# Altium project Bass Guitar Amp.PrjPcb (part 4 of 4)

## Sheet SideGig.SchDoc
size C
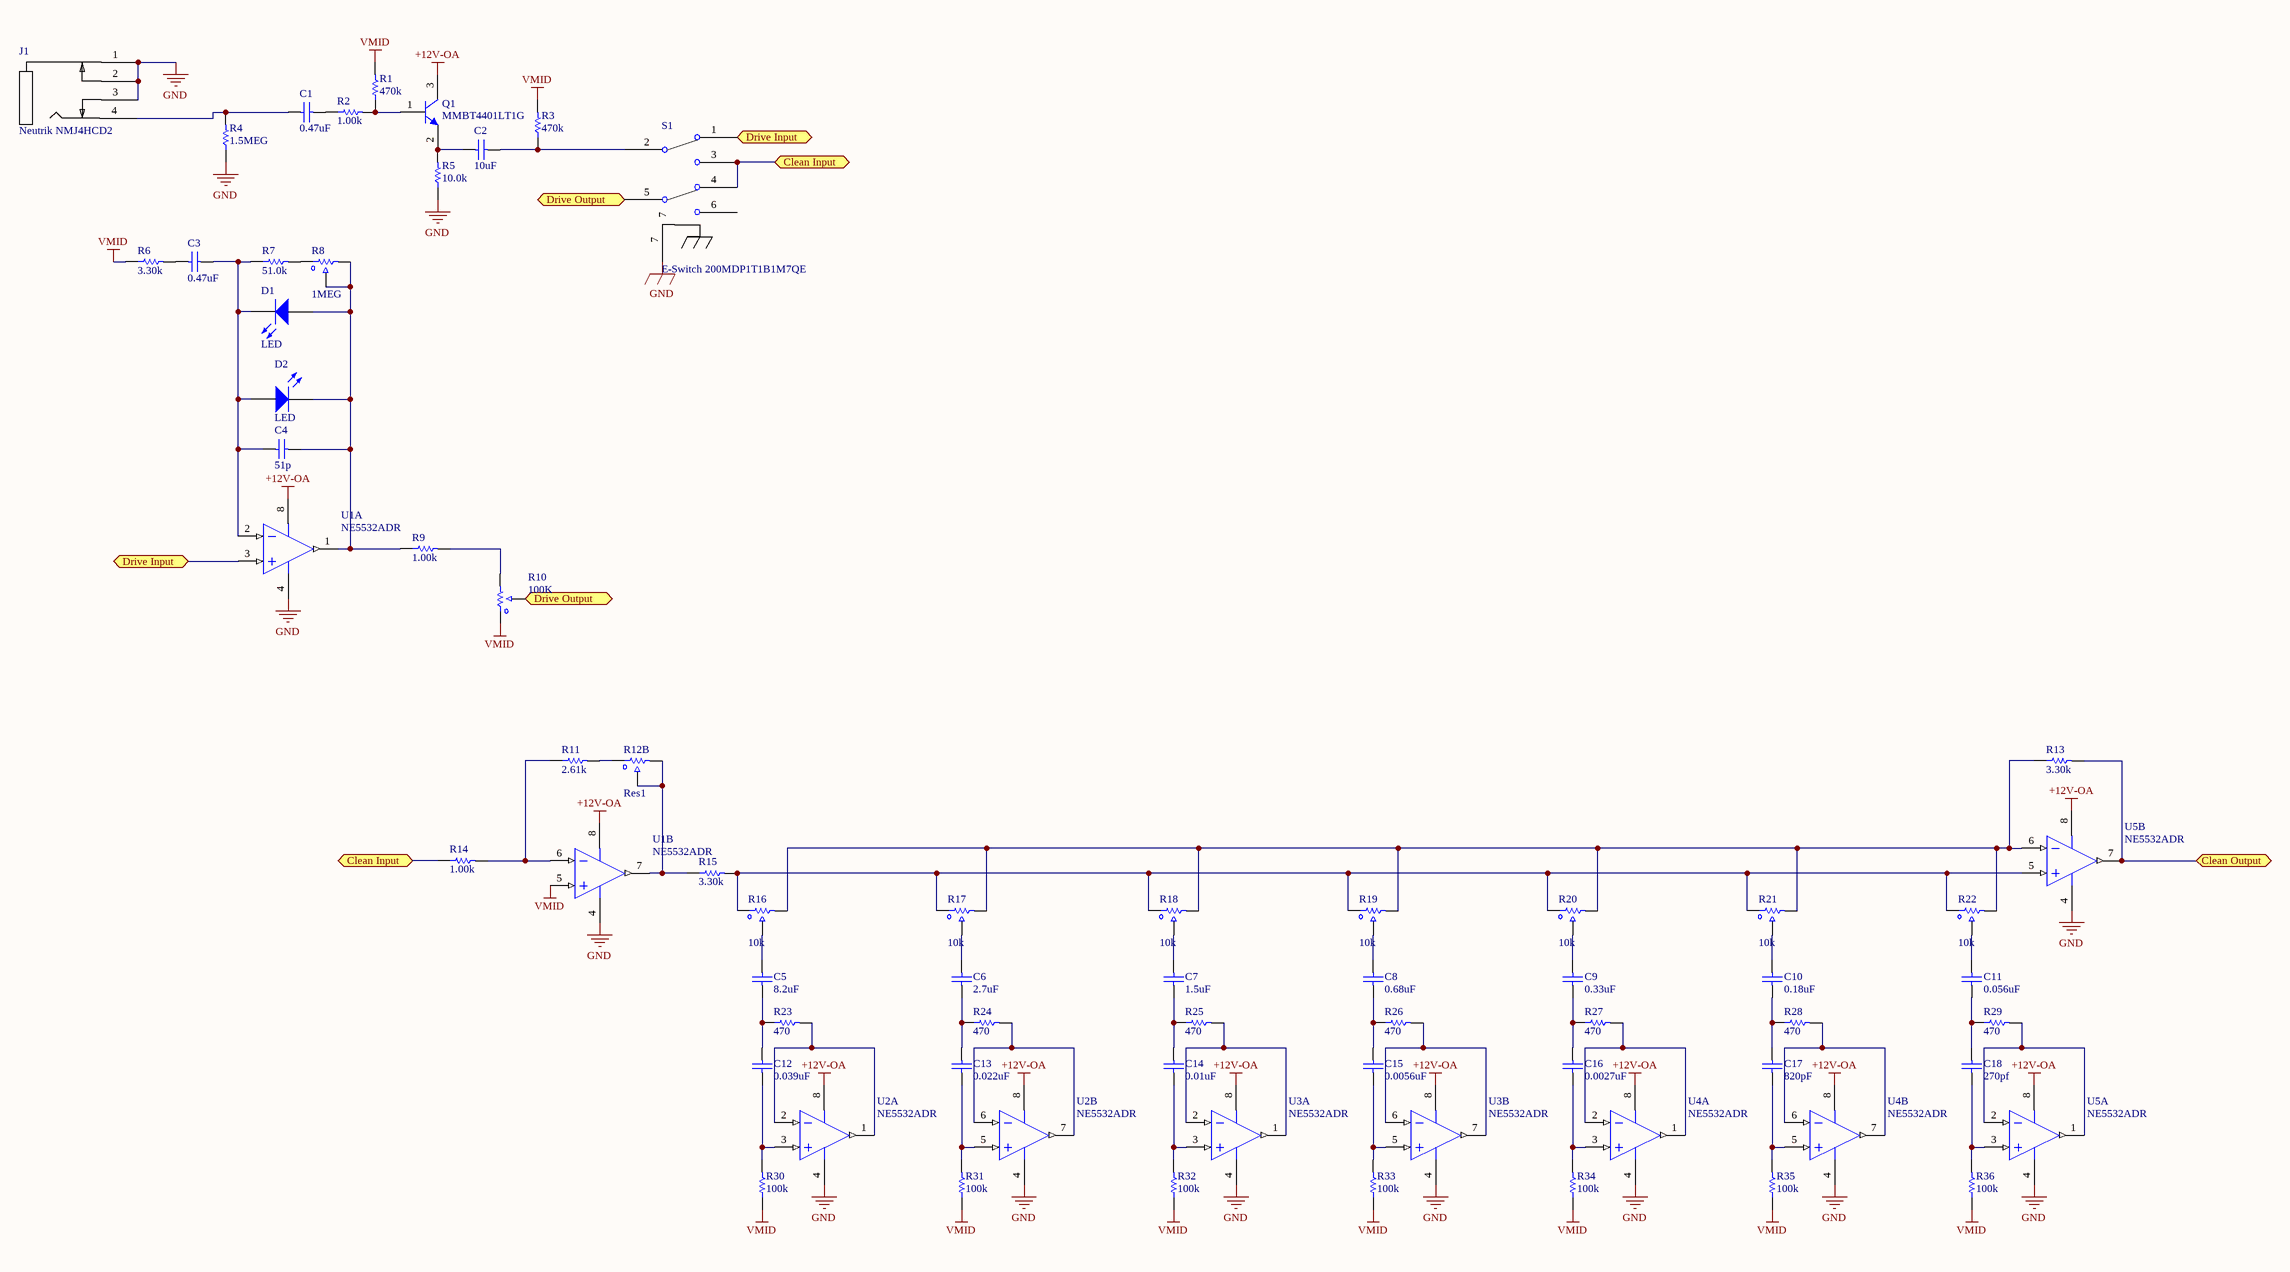
[diagram p4: SideGig.SchDoc]

### Parts
C1  0.47uF  [KEMET-CAP-R82-3.5x7.2x7.5]
C2  10uF  [PCB-5c5sxu4lzqbcrp2k6kwf-1]
C3  0.47uF  [KEMET-CAP-R82-3.5x7.2x7.5]
C4  51p  [PCB-95jwzqqszc08wacjm7pt-1]
C5  8.2uF  [PCB-c6m1kdim6qcj8izte1nm-1]
C6  2.7uF  [PCB-0jy2cnoig77n7x90nrde-1]
C7  1.5uF  [PNSC-ECW-FA2J104J-2_V]
C8  0.68uF  [PCB-u2hk6yule89p95nzo6je-1]
C9  0.33uF  [PCB-6op8lio2jwcmvqj359j9-1]
C10  0.18uF  [PCB-0jy2cnoig77n7x90nrde-1]
C11  0.056uF  [CAPC3216X180X55NL20T25]
C12  0.039uF  [CAPC3216X125X55NL15T25]
C13  0.022uF  [PCB-4ogqrbmu6k7z43hywnoj-1]
C14  0.01uF  [CAPC1608X90X35ML10T15]
C15  0.0056uF  [CAPC1608X90X35NL10T15]
C16  0.0027uF  [CAPC1608X90X35ML10T15]
C17  820pF  [PCB-ek4a7t2xlu3b3uffgdw1-1]
C18  270pf  [PCB-tqk94dkdaskokld6sqgm-1]
D1  LED  [PCB-zilynnwjnvy4h7a9jrio-1]
D2  LED  [PCB-xdpqkswxioq5a4c2f505-1]
J1  Neutrik NMJ4HCD2  [PCB-ulk4fqr0p4xs83lqqzbi-1]
Q1  MMBT4401LT1G  [ONSC-SOT-23-3-318-08_V]
R1  470k  [RESC1609X55X28LL05T18]
R2  1.00k  [RESC1609X55X28LL05T18]
R3  470k  [RESC1609X55X28LL05T18]
R4  1.5MEG  [RESC1608X55X30LL15T15]
R5  10.0k  [RESC1609X55X28LL05T18]
R6  3.30k  [RESC1609X55X28LL05T18]
R7  51.0k  [RESC1609X55X28LL05T18]
R8  1MEG  [PCB-qt6dwgo6hvmsfr7xkbkw-1]
R9  1.00k  [RESC1609X55X28LL05T18]
R10  100K  [PCB-3c7eria7znpasna51pjn-1]
R11  2.61k  [PCB-2fy4x9bysi6rpexrr8fu-1]
R12  Res1  [PCB-3c7eria7znpasna51pjn-1]  (part B of 2)
R13  3.30k  [RESC1609X55X28LL05T18]
R14  1.00k  [RESC1609X55X28LL05T18]
R15  3.30k  [RESC1609X55X28LL05T18]
R16  10k  [PCB-3c7eria7znpasna51pjn-1]
R17  10k  [PCB-3c7eria7znpasna51pjn-1]
R18  10k  [PCB-3c7eria7znpasna51pjn-1]
R19  10k  [PCB-3c7eria7znpasna51pjn-1]
R20  10k  [PCB-3c7eria7znpasna51pjn-1]
R21  10k  [PCB-3c7eria7znpasna51pjn-1]
R22  10k  [PCB-3c7eria7znpasna51pjn-1]
R23  470  [RESC1609X55X28LL05T18]
R24  470  [RESC1609X55X28LL05T18]
R25  470  [RESC1609X55X28LL05T18]
R26  470  [RESC1609X55X28LL05T18]
R27  470  [RESC1609X55X28LL05T18]
R28  470  [RESC1609X55X28LL05T18]
R29  470  [RESC1609X55X28LL05T18]
R30  100k  [RESC1609X55X28LL05T18]
R31  100k  [RESC1609X55X28LL05T18]
R32  100k  [RESC1609X55X28LL05T18]
R33  100k  [RESC1609X55X28LL05T18]
R34  100k  [RESC1609X55X28LL05T18]
R35  100k  [RESC1609X55X28LL05T18]
R36  100k  [RESC1609X55X28LL05T18]
S1  E-Switch 200MDP1T1B1M7QE  [PCB-n7wal9a472qnn3v0pqv9-1]
U1  NE5532ADR  [TI-D8_L]  (parts A,B of 2)
U2  NE5532ADR  [TI-D8_L]  (parts A,B of 2)
U3  NE5532ADR  [TI-D8_L]  (parts A,B of 2)
U4  NE5532ADR  [TI-D8_L]  (parts A,B of 2)
U5  NE5532ADR  [TI-D8_L]  (parts A,B of 2)

### Ports
Clean Input, Clean Output, Drive Input, Drive Output

### Nets
+12V-OA: Q1.3(C) U1.8(VCC+) U2.8(VCC+) U3.8(VCC+) U4.8(VCC+) U5.8(VCC+)
GND: J1.1 J1.2 J1.3 R4.1 R5.1 S1.7 U1.4(VCC-) U2.4(VCC-) U3.4(VCC-) U4.4(VCC-) U5.4(VCC-)
VMID: R1.2 R3.2 R6.1 R10.1 R30.1 R31.1 R32.1 R33.1 R34.1 R35.1 R36.1 U1.5(IN2+)
NetC1_1: C1.1 J1.4 R4.2
NetC1_2: C1.2 R2.1
NetC2_1: C2.1 Q1.2(E) R5.2
NetC2_2: C2.2 R3.1 S1.2
NetC3_1: C3.1 R6.2
NetC3_2: C3.2 C4.1 D1.2(K) D2.A R7.1 U1.2(IN1-)
NetC4_2: C4.2 D1.1(A) D2.K R8.2 R8.3 R9.1 U1.1(OUT1)
NetC5_1: C5.1 C12.2 R23.1
NetC5_2: C5.2 R16.2
NetC6_1: C6.1 C13.2 R24.1
NetC6_2: C6.2 R17.2
NetC7_1: C7.1 C14.2 R25.1
NetC7_2: C7.2 R18.2
NetC8_1: C8.1 C15.2 R26.1
NetC8_2: C8.2 R19.2
NetC9_1: C9.1 C16.2 R27.1
NetC9_2: C9.2 R20.2
NetC10_1: C10.1 C17.2 R28.1
NetC10_2: C10.2 R21.2
NetC11_1: C11.1 C18.2 R29.1
NetC11_2: C11.2 R22.2
NetC12_1: C12.1 R30.2 U2.3(IN1+)
NetC13_1: C13.1 R31.2 U2.5(IN2+)
NetC14_1: C14.1 R32.2 U3.3(IN1+)
NetC15_1: C15.1 R33.2 U3.5(IN2+)
NetC16_1: C16.1 R34.2 U4.3(IN1+)
NetC17_1: C17.1 R35.2 U4.5(IN2+)
NetC18_1: C18.1 R36.2 U5.3(IN1+)
NetC21_1: R13.2 U5.7(OUT2) ; port Clean Output
NetQ1_1: Q1.1(B) R1.1 R2.2
NetR7_2: R7.2 R8.1
NetR9_2: R9.2 R10.3
NetR10_2: R10.2 S1.5 ; port Drive Output
NetR11_1: R11.1 R14.2 U1.6(IN2-)
NetR11_2: R11.2 R12.R2_1
NetR12_R2_2: R12.R2_2 R12.R2_3 R15.1 U1.7(OUT2)
NetR13_1: R13.1 R16.3 R17.3 R18.3 R19.3 R20.3 R21.3 R22.3 U5.6(IN2-)
NetR14_1: R14.1 S1.3 S1.4 ; port Clean Input
NetR15_2: R15.2 R16.1 R17.1 R18.1 R19.1 R20.1 R21.1 R22.1 U5.5(IN2+)
NetR23_2: R23.2 U2.1(OUT1) U2.2(IN1-)
NetR24_2: R24.2 U2.6(IN2-) U2.7(OUT2)
NetR25_2: R25.2 U3.1(OUT1) U3.2(IN1-)
NetR26_2: R26.2 U3.6(IN2-) U3.7(OUT2)
NetR27_2: R27.2 U4.1(OUT1) U4.2(IN1-)
NetR28_2: R28.2 U4.6(IN2-) U4.7(OUT2)
NetR29_2: R29.2 U5.1(OUT1) U5.2(IN1-)
NetS1_1: S1.1 U1.3(IN1+) ; port Drive Input

Not connected (* = marked no-connect by the designer): S1 6

### Library data of the parts
C1 C3 = CMP-e1ac281961ad3e6b-2: Cap Film 0.47uF 63V PET 5% (7.2 X 3.5 X 7.5mm) Radial Plastic Rectangular Can 5mm 105C Automotive Bulk; Manufacturer: Kemet; Manufacturer Part Number: R82DC3470AA60J; Capacitance: 0.47uF; Octopart URL: https://octopart.com/r82dc3470aa60j-kemet-12559719
C2 = CMP-f13b3967d5202efc-1: as C49 on sheet Power Stage; RoHS: Compliant; Capacitance: 10uF; OctopartID: f13b3967d5202efc
C4 = CMP-0fc2c645c1d4d005-1: Cap Ceramic 51pF 50VDC C0G 5% SMD 0603 Paper T/R; Manufacturer Part Number: CL10C510JB8NNNC; Manufacturer: Samsung; Voltage Rating (DC): 50.0 V; Capacitance: 51.0 pF; Dielectric Characteristic: C0G/NP0; Octopart URL: http://octopart.com/cl10c510jb8nnnc-samsung-9300848; Case/Package: 0603; OctopartID: 0fc2c645c1d4d005; Capacitance Tolerance: ±5%
C5 = CMP-7a00b150261aa5c7-1: Capacitor; Polyester Met; Cap 8.2 uF; Tol 10%; Vol-Rtg 100 VDC; Radial; Straight; Bulk; Manufacturer Part Number: ECQ-E1825KF; Voltage Rating (DC): 100 V; Lead Length: 20.0 mm; Size-Height: 20.0 mm; Dielectric Material: Polyester; Termination Style: Straight; OctopartID: 7a00b150261aa5c7; Mounting Style: Through Hole; RoHS: Compliant; Octopart URL: http://octopart.com/ecq-e1825kf-panasonic-39483772; Capacitance Tolerance: ±10%
C6 = CMP-5ac59336f0388502-1: CAPACITOR FILM, 2.7UF, 250V, 5%, RADIAL; Capacitance: 2.7µF; Capacitance Toleranc; Voltage Rating (DC): 250 V; Capacitance Tolerance: ±5%
C7 = CMP-1966d1689134c6a1-1: CAPACITOR FILM, 1.5UF, 630V, 5%, RADIAL; Capacitance: 1.5µF; Capacitance Toleranc; Manufacturer Part Number: ECQ-E6155JF; Capacitance: 1.50 F; Dielectric Material: Polyester; Octopart URL: http://octopart.com/ecq-e6155jf-panasonic-17083700; OctopartID: 1966d1689134c6a1; RoHS: Compliant
C8 = CMP-8f2c4625e29750eb-1: Cap Film 0.68uF 250V PET 5% (18 X 7 X 12.5mm) Radial Plastic Rectangular Can 15mm 125C Automotive Bulk; Manufacturer: TDK; Lead Length: 6.00 mm; Capacitance: 680 nF; Mounting Style: Through Hole; Capacitance Tolerance: ±5%; Voltage Rating (DC): 250 V; Packaging: Bulk; RoHS: Compliant; Octopart URL: https://octopart.com/b32522c3684j-epcos-215261
C9 = CMP-7296bb5cc553ad51-2: Cap Film 0.33uF 63V PET 5% (7.2 X 3.5 X 7.5mm) Radial Plastic Rectangular Can 5mm 105C Automotive Bulk; Manufacturer: Kemet; Mounting Style: Through Hole; OctopartID: 7296bb5cc553ad51; Octopart URL: http://octopart.com/r82dc3330aa60j-kemet-12620451
C10 = CMP-50809973e1bc8f47-1: Cap Film 0.18uF 250V PET 5% (10.3 X 5 X 9.7mm) Radial 7.5mm 105°C Bulk; Manufacturer: Panasonic; OctopartID: 50809973e1bc8f47
C11 = CMP-199982-2: CAP CER 0.056UF 50V 5% NP0 1206; Manufacturer Part Number: GRM31C5C1H563JA01L; Manufacturer: Murata; Capacitance: 5.6e-08 F; Case/Package (SI): 3216; Dielectric Characteristic: C0G/NP0; Lead-Free Status: Lead Free; Voltage Rating (DC): 50.0 V; Capacitance Tolerance: ±5%; Case/Package: 1206; Lifecycle Status: Active; Mounting Style: Surface Mount; Octopart Url: https://octopart.com/grm31c5c1h563ja01l-murata-196978; OctopartID: c4f80df1e0ec1b3f; RoHS: Compliant; Size-Height: 0.0016 m; Size-Length: 0.0032 m; Size-Thickness: 0.0016 m; Size-Width: 0.0016 m
C12 = CMP-128810-3: Cap Ceramic 0.039uF 50V C0G 5% SMD 1206 125C Plastic T/R; Manufacturer: Murata; Manufacturer Part Number: GRM31M5C1H393JA01L; Voltage Rating (DC): 50.0 V; Case/Package (SI): 3216; Lead-Free Status: Lead Free; Capacitance: 3.9e-08 F; Dielectric Characteristic: C0G/NP0; RoHS: Compliant; Lifecycle Status: Active; Case/Package: 1206; OctopartID: e8b621bfcca13771; Size-Height: 0.00115 m; Size-Thickness: 0.00115 m; Size-Length: 0.0032 m; Capacitance Tolerance: ±5%; Size-Width: 0.0016 m; Octopart Url: https://octopart.com/grm31m5c1h393ja01l-murata-196977; Mounting Style: Surface Mount
C13 = CMP-fbc8327d7bd3240f-1: Cap Film 0.022uF 100V PET 5% (7.2 X 2.5 X 6.5mm) Radial Plastic Rectangular Can 5mm 105C Automotive Bulk; Manufacturer Part Number: R82EC2220AA50J; Packaging: Bulk; Mounting Style: Through Hole; RoHS: Compliant
C14 = CMP-8261565-5: Multilayer Ceramic Capacitors MLCC - SMD/SMT 0603 10,000pF 50volt C0G +/-5%; Manufacturer Part Number: GRM1885C1H103JA01D; Manufacturer: Murata; Dielectric Characteristic: C0G/NP0; Voltage Rating (DC): 50.0 V; Capacitance Tolerance: ±5%; Lead-Free Status: Lead Free; Capacitance: 1e-08 F; Case/Package (SI): 1608; RoHS: Compliant; Lifecycle Status: Active; Size-Length: 0.0016 m; REACH SVHC Compliance: No SVHC; OctopartID: 77b2bf051f60a875; Size-Thickness: 0.0008 m; Octopart Url: https://octopart.com/grm1885c1h103ja01d-murata-29183412; Size-Width: 0.0008 m
C15 = CMP-95ae5d1e3aa24a69-1: 0603 5600 pF 50 V ±5% Tolerance C0G/NP0 Monolithic Ceramic Chip Capacitor; Lead-Free Status: Lead Free; Case/Package (SI): 1608
C16 = CMP-119693-3: CAP CER 2700PF 50V 5% NP0 0603; Manufacturer Part Number: GRM1885C1H272JA01D; Manufacturer: Murata; Capacitance: 2.7e-09 F; Case/Package (SI): 1608; Dielectric Characteristic: C0G/NP0; Lead-Free Status: Lead Free; Voltage Rating (DC): 50.0 V; Capacitance Tolerance: ±5%; Lifecycle Status: Active; Mounting Style: Surface Mount; Octopart Url: https://octopart.com/grm1885c1h272ja01d-murata-196902; OctopartID: 348efd8710ceeb49; REACH SVHC Compliance: No SVHC; RoHS: Compliant; Size-Height: 0.0008 m; Size-Length: 0.0016 m; Size-Thickness: 0.0008 m; Size-Width: 0.0008 m
C17 = CMP-c3190a9e587f1cde-1: 0603 820 pF 50 V ±5 % Tolerance NP0 SMT Multilayer Ceramic Capacitor; Manufacturer: Yageo; Manufacturer Part Number: CC0603JRNPO9BN821; Lead-Free Status: Lead Free; Dielectric Characteristic: C0G/NP0; Voltage Rating (DC): 50.0 V; Capacitance Tolerance: ±5%; OctopartID: c3190a9e587f1cde; Packaging: Tape & Reel (TR); Capacitance: 820 pF; Mounting Style: Surface Mount; Octopart URL: https://octopart.com/cc0603jrnpo9bn821-yageo-9289216; Number of Pins: 2; Case/Package: 0603; RoHS: Compliant
C18 = CMP-77e5be62bc55a822-1: CL10 Series 270 pF 50 V ±5 % Tolerance C0G SMT Multilayer Ceramic Capacitor
D1 = CMP-a68c6f8ee068794b-1: Red 4.75 mm 60 º Intensity Min 19 mcd Typical 60 mcd Red Diffused LED; Manufacturer Part Number: LTL-10223W; Manufacturer: Lite-On; Wavelength: 635 nm; Luminous Intensity: 60.0 mcd; Viewing Angle: 60 °; Forward Voltage: 2.00 V; Packaging: Bulk; Size-Diameter: 4.75 mm; Size-Height: 7.20 mm; Mounting Style: Through Hole; RoHS: Compliant
D2 = CMP-0a37c3354b1ad5f0-1: LED; 3mm; blue; 240-1900mcd; 30°; Front: convex; Pitch: 2.54mm; Manufacturer Part Number: LTL1CHTBK4; Manufacturer: Lite-On; Color: Blue; Packaging: Bag; OctopartID: 0a37c3354b1ad5f0; Mounting Style: Through Hole; Octopart URL: http://octopart.com/ltl1chtbk4-lite-on-549963
J1 = CMP-1d86d487adb1c241-4: Jack 1/4" mono switched - PCBH - supplied with chrome nose nut and NRJ-WB; Manufacturer Part Number: NMJ4HCD2
Q1 = CMP-857796-2: Switching Transistor, NPN Silicon, 3-Pin SOT-23, Pb-Free, Tape and Reel; Current Rating: 0.6 A; Lead-Free Status: Lead Free; Power Dissipation: 0.225 W; Voltage Rating (DC): 40.0 V; Case/Package: SOT-23; Lifecycle Status: Active; Mounting Style: Surface Mount; Number of Pins: 3; Octopart Url: https://octopart.com/mmbt4401lt1g-on+semiconductor-15417; OctopartID: 030cca061a53dccb; Polarity: NPN; REACH SVHC Compliance: No SVHC; RoHS: Compliant
R1 R3 = CMP-f7e03fd772d42827-1: Res Thin Film 0603 470K Ohm 0.1% 1/10W ±25ppm/°C Molded SMD SMD Paper T/R; Manufacturer Part Number: MCT06030D4703BP100; Lead-Free Status: Lead Free
R2 R9 R14 = CMP-7be4b0639f6ea423-1: Precision Thin Film Smnt Resistor 0603 Case 1kOhm +/-0.1% 0.1W +/-25ppm/degC; Manufacturer Part Number: MCT06030D1001BP100; Manufacturer: Vishay; Resistance: 1.00 kΩ; Voltage Rating (DC): 50.0 V; Lead-Free Status: Lead Free; OctopartID: 7be4b0639f6ea423; Size-Width: 850 µm; Case/Package: 0603; Size-Height: 450 µm; Octopart URL: http://octopart.com/mct06030d1001bp100-vishay-42844652; Size-Length: 1.55 mm; RoHS: Compliant
R4 = CMP-3681775-2: Thick Film Resistors - SMD 0603 1.5Mohms 1% Tol; Manufacturer Part Number: ERJ-3EKF1504V; Manufacturer: Panasonic; Lead-Free Status: Lead Free; Power Rating: 0.1 W; Resistance: 1500000.0 Ω; Voltage Rating (DC): 75.0 V; Case/Package: 0603; Lifecycle Status: Not Listed by Manufacturer; Mounting Style: Surface Mount; Octopart Url: https://octopart.com/erj-3ekf1504v-panasonic-55421490; OctopartID: f919335e764d26de; Packaging: Cut Tape (CT); Resistance Tolerance: ±1%; RoHS: Compliant; Size-Height: 0.00045 m; Size-Length: 0.0016 m; Size-Width: 0.0008 m
R5 = CMP-893e42b9f3a056f9-1: as R110-R113 on sheet Power Management; Packaging: Tape & Reel (TR); RoHS: Compliant; Mounting Style: Surface Mount; Size-Length: 1.55 mm; Size-Width: 850 µm; Octopart URL: http://octopart.com/mct06030d1002bp100-vishay-42819576; Case/Package: 0603; Size-Height: 450 µm
R6 R13 R15 = CMP-182ad3b0fdf8c7ed-1: Precision Thin Film Smnt Resistor 0603 Case 3.3kOhm +/-0.1% 0.1W +/-25ppm/C; Manufacturer: Vishay; Manufacturer Part Number: MCT06030D3301BP100; Resistance: 3.30 kΩ; Resistance Tolerance: ±0.1%; Octopart URL: http://octopart.com/mct06030d3301bp100-vishay-43040948; RoHS: Compliant; Size-Height: 450 µm; OctopartID: 182ad3b0fdf8c7ed; Case/Package: 0603; Mounting Style: Surface Mount; Size-Width: 850 µm
R7 = CMP-51fc9a58b3ad8e3b-1: Res Thnflm 0603 51k Ohm 0.1% 1/10w 25ppm/ c Smd; Case/Package: 0603; Size-Width: 850 µm
R8 = CMP-b83a70bb560467fd-1: Panel Control - 9mm-St-Carbon; Manufacturer Part Number: PTD901-2015F-A105; Manufacturer: Bourns; Resistance: 1MEG; Octopart URL: http://octopart.com/ptd901-2015f-a105-bourns-25938776; OctopartID: b83a70bb560467fd; Mounting Style: PCB, Board, Panel
R10 = CMP-5ca0950a795e8367-1: Res Carbon Film POT 100K Ohm 10% 1/40W 1(Elec)/1(Mech)Turn 6mm (32.2 X 9.5 X 11.3mm) Pin Panel Mount/Through Hole; Mounting Style: Through Hole, Panel; Octopart URL: http://octopart.com/ptd904-1015f-a104-bourns-10485912; Packaging: Bulk; OctopartID: 5ca0950a795e8367
R11 = CMP-9c6957e4a20743ae-1: Res Thin Film 0603 2.61K Ohm 0.1% 1/10W ±25ppm/°C Molded SMD Paper T/R; Manufacturer: Vishay; Manufacturer Part Number: MCT06030D2611BP100; Resistance: 2.61 kΩ; Power Rating: 100 mW; Size-Length: 1.55 mm; Resistance Tolerance: ±0.1%; Packaging: Tape & Reel (TR)
R12 = CMP-f1923a8ba4e42e55-1: Panel Control - 9mm-St-Carbon; Packaging: Tray
R16-R22 = CMP-ada7643275df7260-1: Res Carbon Film POT 10K Ohm 10% 1/20W 1(Elec)/1(Mech)Turn 6mm (22.05 X 9.5 X 11.3mm) Pin Panel Mount/Through Hole; Manufacturer Part Number: PTD901-1215F-B103; Octopart URL: http://octopart.com/ptd901-1215f-b103-bourns-10485022; Mounting Style: Through Hole, Panel; OctopartID: ada7643275df7260
R23-R29 = CMP-5b919035b9e18456-1: Precision Thin Film Smnt Resistor 0603 Case 470Ohm +/-0.1% 0.1W +/-25ppm/degC; Manufacturer: Vishay; Manufacturer Part Number: MCT06030D4700BP100; Resistance: 470 Ω; Resistance Tolerance: ±0.1%; Mounting Style: Surface Mount; Size-Length: 1.55 mm; OctopartID: 5b919035b9e18456
R30-R36 = CMP-81a44a23e0045e63-1: Precision Thin Film Smnt Resistor 0603 Case 100kOhm +/-0.1% 0.1W +/-25ppm/C; Manufacturer Part Number: MCT06030D1003BP100; Manufacturer: Vishay; Resistance Tolerance: ±0.1%; Lead-Free Status: Lead Free; Temperature Coefficient: 25.0 ppm/°C; Packaging: Tape & Reel (TR); OctopartID: 81a44a23e0045e63; Size-Length: 1.55 mm; Case/Package: 0603; Size-Width: 850 µm
S1 = CMP-28b1e1d0a5f2f776-2: Toggle Switch; Contact Configuration: DPDT; Switch Function: On-On; Actuator Type: Standard Round; Actuator Length: 9...; OctopartID: 28b1e1d0a5f2f776; Octopart URL: http://octopart.com/200mdp1t1b1m7qe-e-switch-7055397
U1-U5 = CMP-13597030-2: as U14#1 on sheet Power Stage; Gain Bandwidth Product: 10000000.0 Hz; Lifecycle Status: Active; Mounting Style: Surface Mount; Number of Circuits: 2; Number of Pins: 8; Octopart Url: https://octopart.com/ne5532adr-texas+instruments-409175; OctopartID: 270fee033c3ef8c8; Packaging: Tape & Reel (TR); REACH SVHC Compliance: No SVHC; RoHS: Compliant

## Nets that join several sheets
+12-OA: Power Management (6 pins), Power Stage (5 pins)
+12V-OA: Crossover (U9.8 U10.8 U11.8), IO Management (U6.8 U7.8 U8.8), Power Management (36 pins), Power Stage (U14#1.8 U14#2.8 U15#1.8 U15#2.8), SideGig (6 pins)
GND: Crossover (U9.4 U10.4 U11.4), IO Management (14 pins), Power Management (65 pins), Power Stage (44 pins), SideGig (11 pins)
PVDD: Power Management (9 pins), Power Stage (12 pins)
VMID: Crossover (6 pins), IO Management (8 pins), Power Management (J14.3 U18.1), Power Stage (U14#1.3 U14#2.5 U15#1.3 U15#2.5), SideGig (12 pins)
NetC21_1: IO Management (C21.1), Power Management (J15.3), SideGig (R13.2 U5.7)
NetC30_2: Crossover (C30.2 R62.2 U11.7), IO Management (J3.8)
NetJ2_4: IO Management (J2.4), Power Management (J15.2)
NetJ2_5: IO Management (J2.5), Power Management (J15.1)
NetJ3_2: IO Management (J3.2), Power Management (J15.5), Power Stage (R86.1)
NetJ3_3: Crossover (R64.2 R68.R1_3 U9.1), IO Management (J3.3)
NetJ3_4: Crossover (R66.1), IO Management (5 pins)
NetJ3_7: IO Management (J3.7), Power Management (J15.6), Power Stage (R87.1)
NetJ13_1: Power Management (J13.1 J14.5 R112.1), Power Stage (U16.19)
NetJ14_4: Power Management (J14.4 U19.3), Power Stage (U16.18)
NetJ14_6: Power Management (J14.6 R113.1), Power Stage (U16.21)
NetJ15_4: IO Management (5 pins), Power Management (J15.4)